# EAGLE design Grove Shield for Intel Joule v1.0 (EAGLE 6.4)
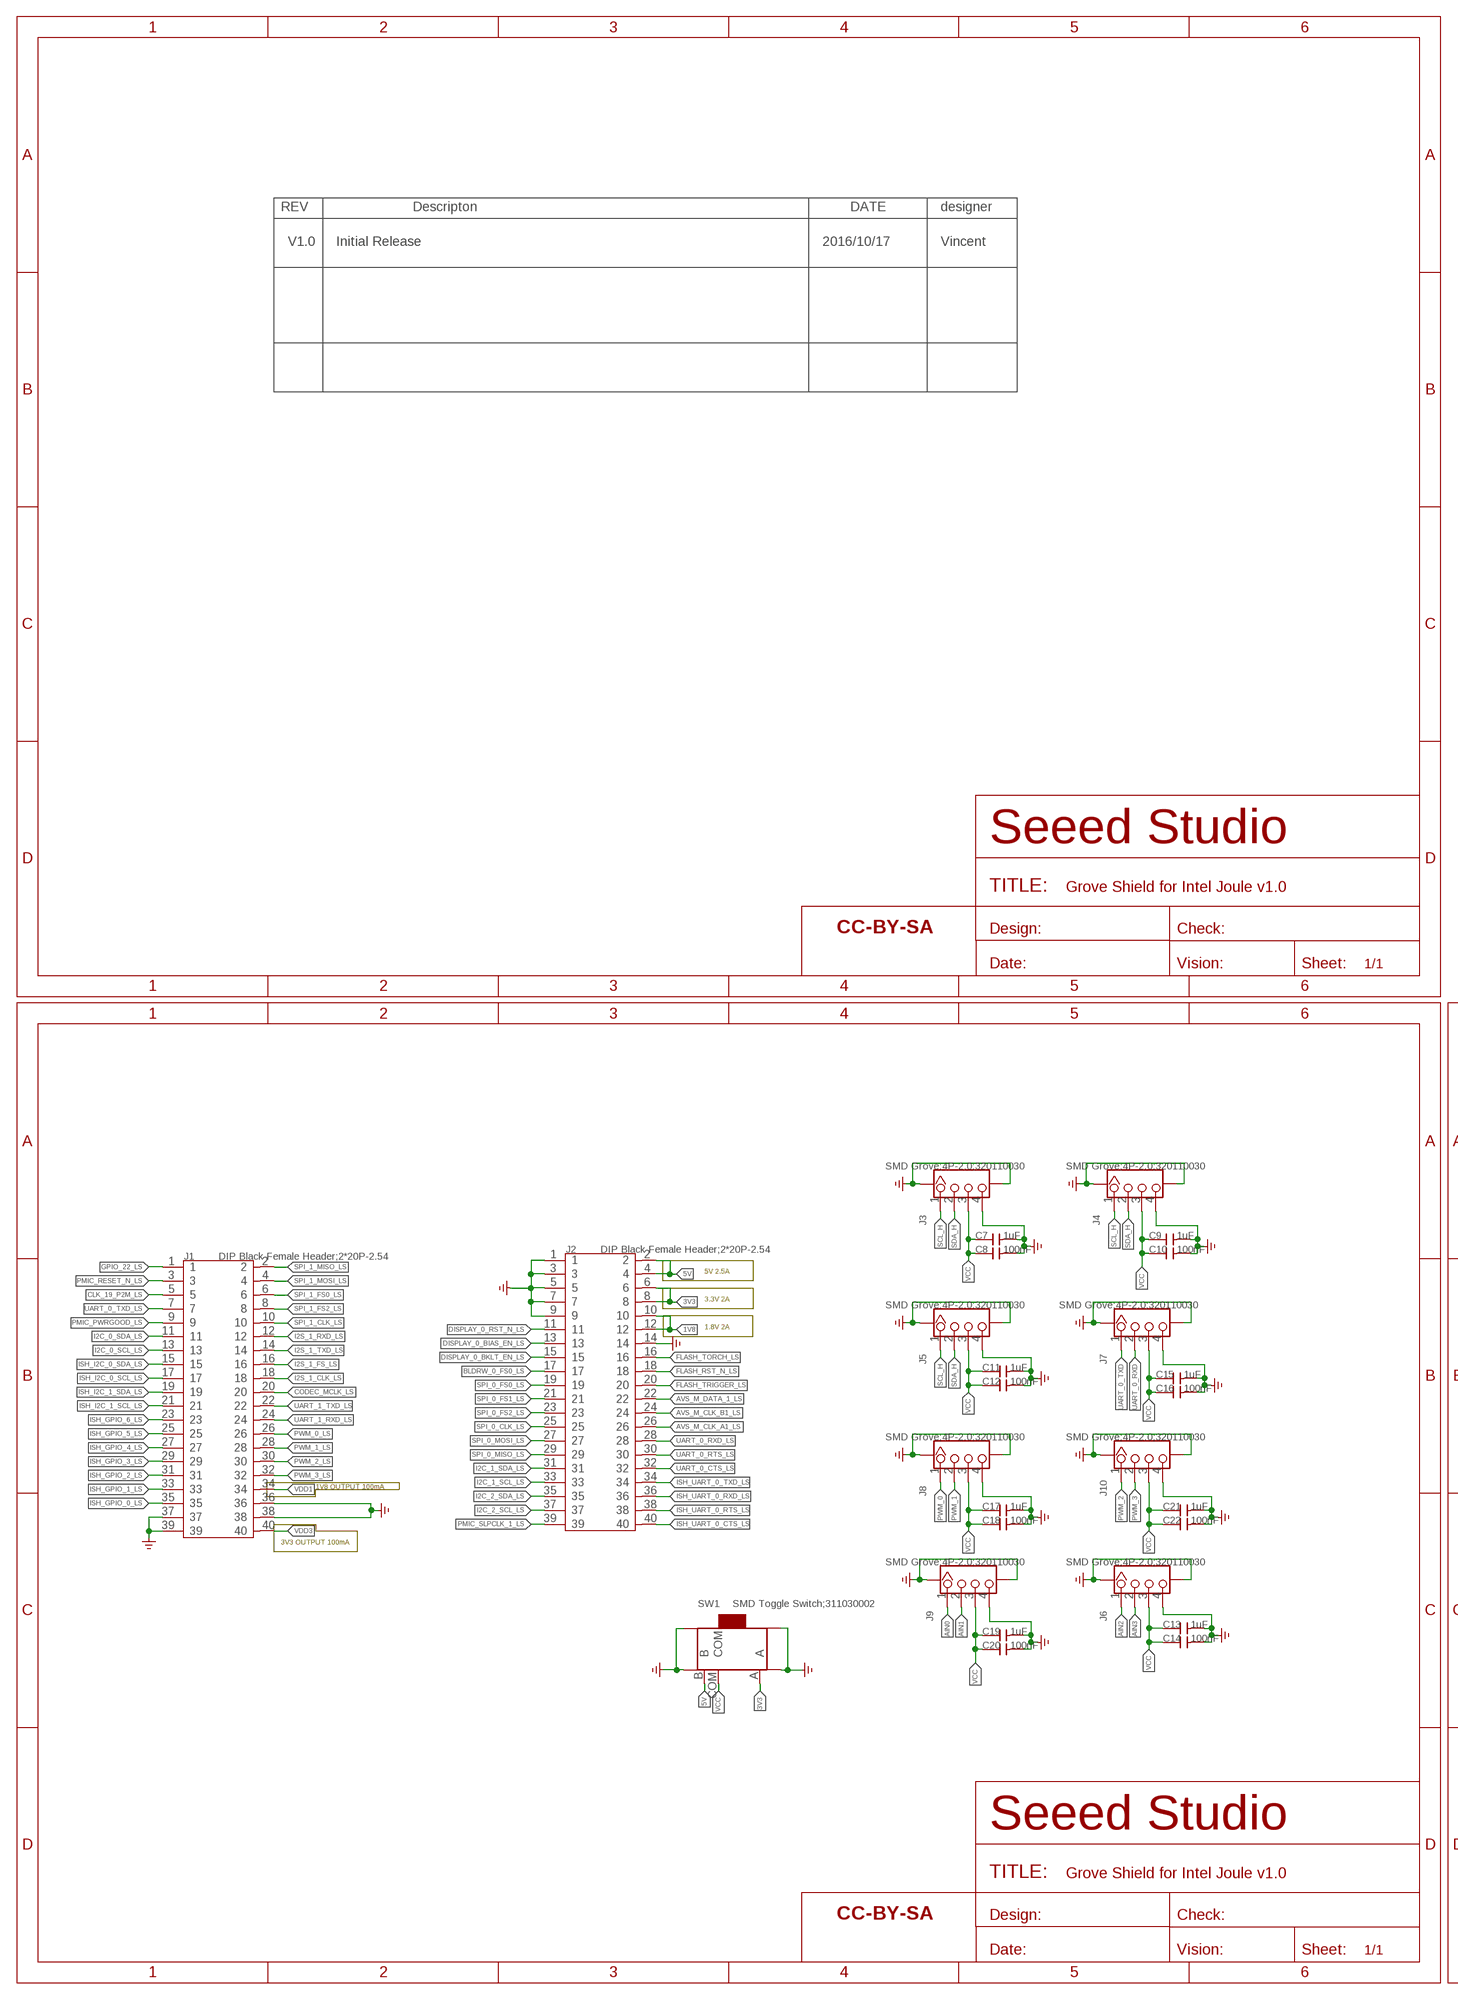
[diagram p0: schematic, sheet 1, part 1 of 2]
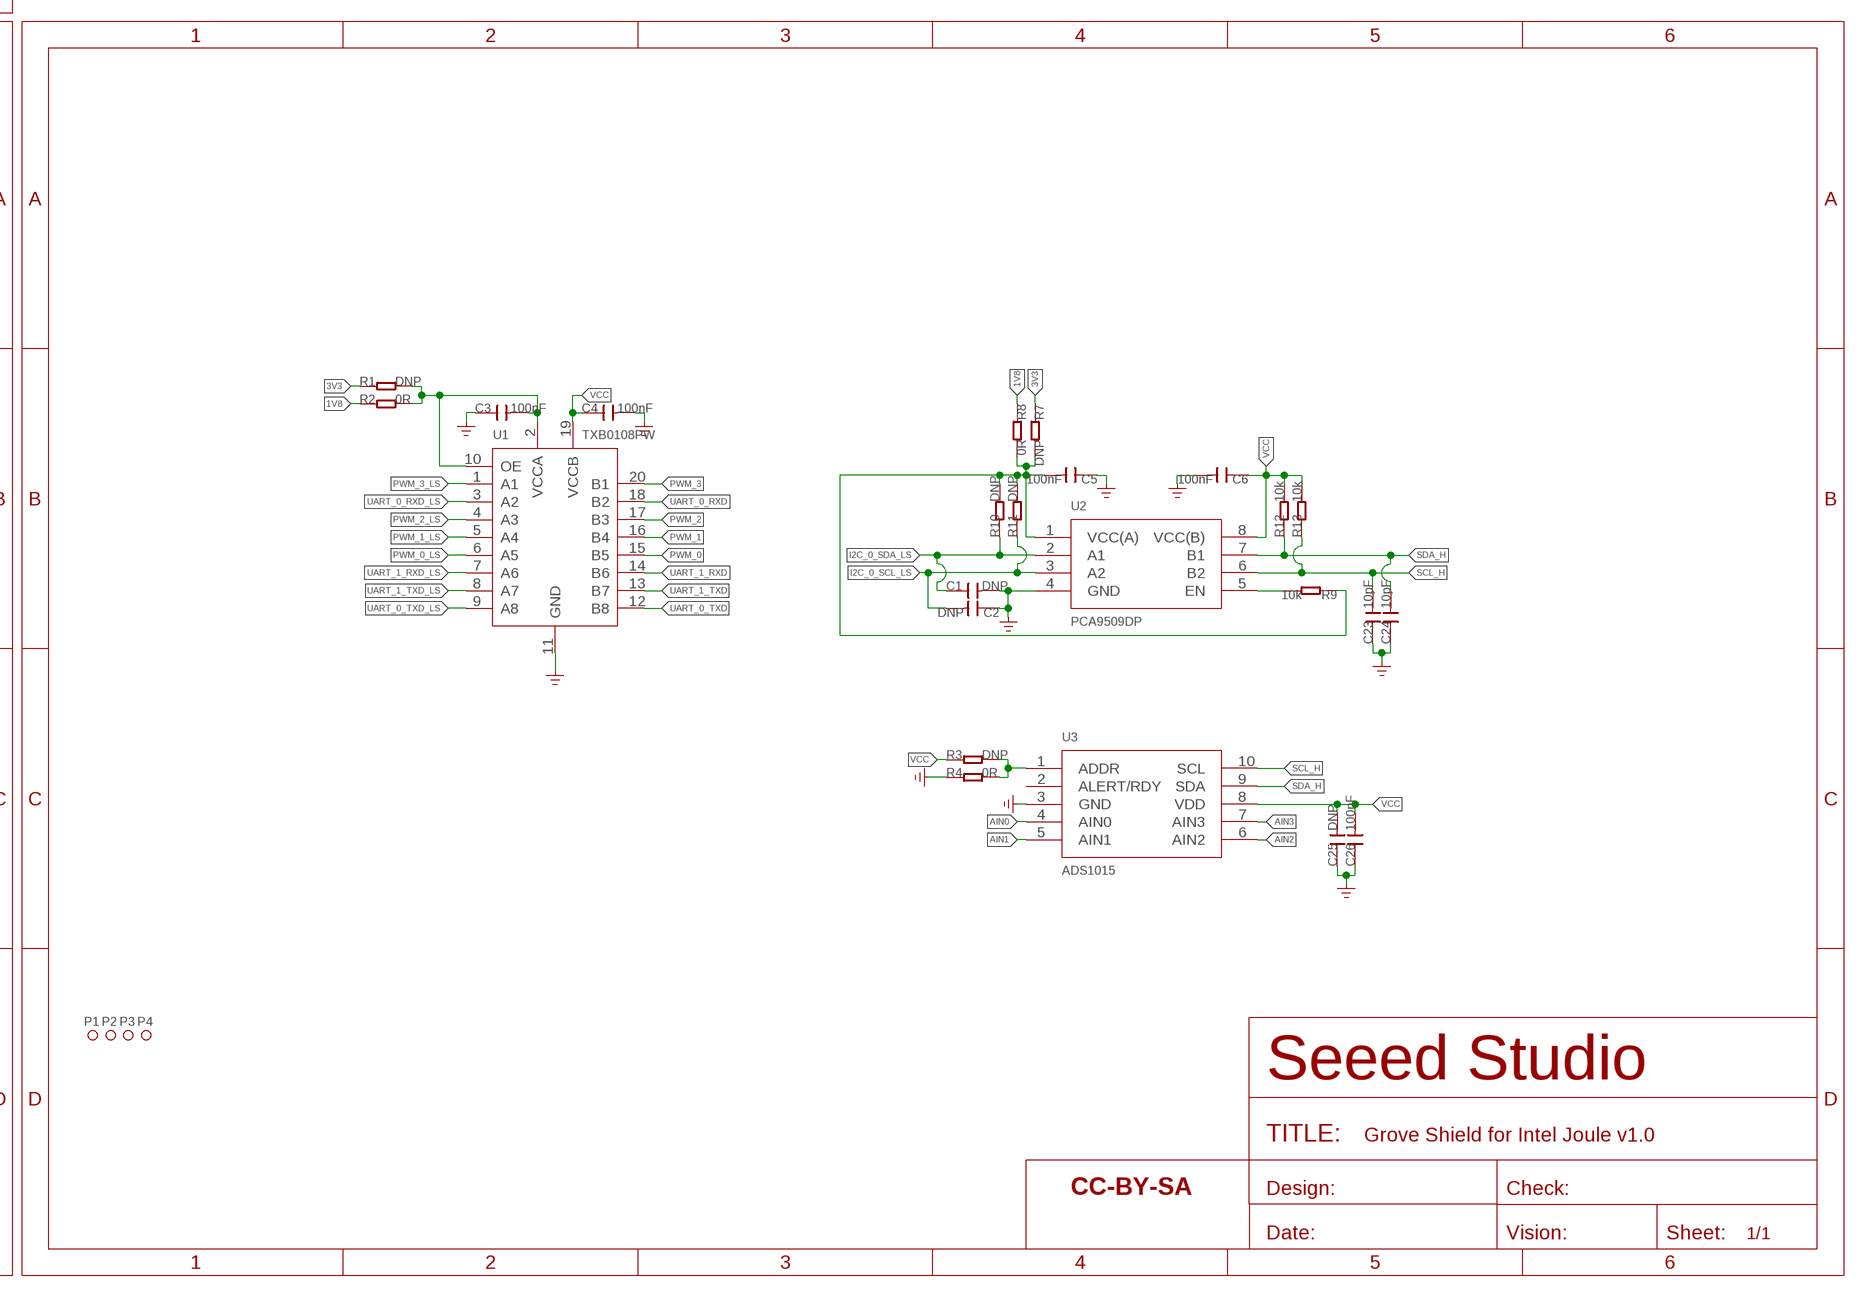
[diagram p1: schematic, sheet 1, part 2 of 2]

## Parts
C1  DNP  CAP-0603  [C0603]
C2  DNP  CAP-0603  [C0603]
C3  100nF  CAP-0603  [C0603]
C4  100nF  CAP-0603  [C0603]
C5  100nF  CAP-0603  [C0603]
C6  100nF  CAP-0603  [C0603]
C7  1uF  CAP-0603  [C0603]
C8  100nF  CAP-0603  [C0603]
C9  1uF  CAP-0603  [C0603]
C10  100nF  CAP-0603  [C0603]
C11  1uF  CAP-0603  [C0603]
C12  100nF  CAP-0603  [C0603]
C13  1uF  CAP-0603  [C0603]
C14  100nF  CAP-0603  [C0603]
C15  1uF  CAP-0603  [C0603]
C16  100nF  CAP-0603  [C0603]
C17  1uF  CAP-0603  [C0603]
C18  100nF  CAP-0603  [C0603]
C19  1uF  CAP-0603  [C0603]
C20  100nF  CAP-0603  [C0603]
C21  1uF  CAP-0603  [C0603]
C22  100nF  CAP-0603  [C0603]
C23  10pF  CAP-0603  [C0603]
C24  10pF  CAP-0603  [C0603]
C25  DNP  CAP-0603  [C0603]
C26  100nF  CAP-0603  [C0603]
FR1  SEEEDSTUDIO-OPEN-SCH-FRAME  [SEEEDSTUDIO-PCB-FRAME]
FR2  SEEEDSTUDIO-OPEN-SCH-FRAME  [SEEEDSTUDIO-PCB-FRAME]
FR3  SEEEDSTUDIO-OPEN-SCH-FRAME  [SEEEDSTUDIO-PCB-FRAME]
J1  DIP Black Female Header;2*20P-2.54  HEADER-2X20P-2.54  [H2X20-2.54MM]
J2  DIP Black Female Header;2*20P-2.54  HEADER-2X20P-2.54  [H2X20-2.54MM]
J3  SMD Grove;4P-2.0;320110030  GROVE-CONNECTOR-SMD'DD'  [HW4-SMD-2.0]
J4  SMD Grove;4P-2.0;320110030  GROVE-CONNECTOR-SMD'DD'  [HW4-SMD-2.0]
J5  SMD Grove;4P-2.0;320110030  GROVE-CONNECTOR-SMD'DD'  [HW4-SMD-2.0]
J6  SMD Grove;4P-2.0;320110030  GROVE-CONNECTOR-SMD'DD'  [HW4-SMD-2.0]
J7  SMD Grove;4P-2.0;320110030  GROVE-CONNECTOR-SMD'DD'  [HW4-SMD-2.0]
J8  SMD Grove;4P-2.0;320110030  GROVE-CONNECTOR-SMD'DD'  [HW4-SMD-2.0]
J9  SMD Grove;4P-2.0;320110030  GROVE-CONNECTOR-SMD'DD'  [HW4-SMD-2.0]
J10  SMD Grove;4P-2.0;320110030  GROVE-CONNECTOR-SMD'DD'  [HW4-SMD-2.0]
P1  MARK-1.0'ANNULAR'  [ROUND-MARK-1.0]
P2  MARK-1.0'ANNULAR'  [ROUND-MARK-1.0]
P3  MARK-1.0'ANNULAR'  [ROUND-MARK-1.0]
P4  MARK-1.0'ANNULAR'  [ROUND-MARK-1.0]
R1  DNP  RES-0603  [R0603]
R2  0R  RES-0603  [R0603]
R3  DNP  RES-0603  [R0603]
R4  0R  RES-0603  [R0603]
R7  DNP  RES-0603  [R0603]
R8  0R  RES-0603  [R0603]
R9  10k  RES-0603  [R0603]
R10  DNP  RES-0603  [R0603]
R11  DNP  RES-0603  [R0603]
R12  10k  RES-0603  [R0603]
R13  10k  RES-0603  [R0603]
SW1  SMD Toggle Switch;311030002  SWITCH-3+4P'90D'  [SW7-SMD-6.7X2.6X1.4MM-90D]
U1  TXB0108PW  LOGIC-TXS0108EPWR  [TSSOP20-0.65-6.5X4.4MM]
U2  PCA9509DP  LOGIC-PCA9509DP  [TSSOP8-0.65-3X3MM]
U3  ADS1015  CONVERTER-ADS1015IDGST-ADC  [SSOP10-0.5-3X3MM]

## Nets
1V8: J2.10 J2.12 R2.1 R8.1
3V3: J2.6 J2.8 R1.1 R7.1 SW1.A
5V: J2.2 J2.4 SW1.B
AIN0: J9.1 U3.4(AIN0)
AIN1: J9.2 U3.5(AIN1)
AIN2: J6.1 U3.6(AIN2)
AIN3: J6.2 U3.7(AIN3)
AVS_M_CLK_A1_LS: J2.26
AVS_M_CLK_B1_LS: J2.24
AVS_M_DATA_1_LS: J2.22
BLDRW_0_FS0_LS: J2.17
CLK_19_P2M_LS: J1.5
CODEC_MCLK_LS: J1.20
DISPLAY_0_BIAS_EN_LS: J2.13
DISPLAY_0_BKLT_EN_LS: J2.15
DISPLAY_0_RST_N_LS: J2.11
FLASH_RST_N_LS: J2.18
FLASH_TORCH_LS: J2.16
FLASH_TRIGGER_LS: J2.20
GND: C1.2 C2.1 C3.1 C4.2 C5.1 C6.2 C7.2 C8.2 C9.2 C10.2 C11.2 C12.2 C13.2 C14.2 C15.2 C16.2 C17.2 C18.2 C19.2 C20.2 C21.2 C22.2 C23.1 C24.1 C25.1 C26.1 J1.36 J1.37 J1.38 J1.39 J2.1 J2.3 J2.5 J2.7 J2.9 J2.14 J3.4 J3.SS1 J3.SS2 J4.4 J4.SS1 J4.SS2 J5.4 J5.SS1 J5.SS2 J6.4 J6.SS1 J6.SS2 J7.4 J7.SS1 J7.SS2 J8.4 J8.SS1 J8.SS2 J9.4 J9.SS1 J9.SS2 J10.4 J10.SS1 J10.SS2 R4.1 SW1.P1(SS1) SW1.P2(SS2) SW1.P3(SS3) SW1.P4(SS4) U1.11(GND) U2.4(GND) U3.3(GND) ; supply symbol labelled GND_POWER
GPIO_22_LS: J1.1
I2C_0_SCL_LS: C2.2 J1.13 R11.1 U2.3(A2)
I2C_0_SDA_LS: C1.1 J1.11 R10.1 U2.2(A1)
I2C_1_SCL_LS: J2.33
I2C_1_SDA_LS: J2.31
I2C_2_SCL_LS: J2.37
I2C_2_SDA_LS: J2.35
I2S_1_CLK_LS: J1.18
I2S_1_FS_LS: J1.16
I2S_1_RXD_LS: J1.12
I2S_1_TXD_LS: J1.14
ISH_GPIO_0_LS: J1.35
ISH_GPIO_1_LS: J1.33
ISH_GPIO_2_LS: J1.31
ISH_GPIO_3_LS: J1.29
ISH_GPIO_4_LS: J1.27
ISH_GPIO_5_LS: J1.25
ISH_GPIO_6_LS: J1.23
ISH_I2C_0_SCL_LS: J1.17
ISH_I2C_0_SDA_LS: J1.15
ISH_I2C_1_SCL_LS: J1.21
ISH_I2C_1_SDA_LS: J1.19
ISH_UART_0_CTS_LS: J2.40
ISH_UART_0_RTS_LS: J2.38
ISH_UART_0_RXD_LS: J2.36
ISH_UART_0_TXD_LS: J2.34
N$1: R9.2 U2.5(EN)
N$2: R3.2 R4.2 U3.1(ADDR)
N$4: C5.2 R7.2 R8.2 R9.1 R10.2 R11.2 U2.1(VCC(A))
N$5: C3.2 R1.2 R2.2 U1.2(VCCA) U1.10(OE)
PMIC_PWRGOOD_LS: J1.9
PMIC_RESET_N_LS: J1.3
PMIC_SLPCLK_1_LS: J2.39
PWM_0: J8.1 U1.15(B5)
PWM_0_LS: J1.26 U1.6(A5)
PWM_1: J8.2 U1.16(B4)
PWM_1_LS: J1.28 U1.5(A4)
PWM_2: J10.1 U1.17(B3)
PWM_2_LS: J1.30 U1.4(A3)
PWM_3: J10.2 U1.20(B1)
PWM_3_LS: J1.32 U1.1(A1)
SCL_H: C23.2 J3.1 J4.1 J5.1 R13.1 U2.6(B2) U3.10(SCL)
SDA_H: C24.2 J3.2 J4.2 J5.2 R12.1 U2.7(B1) U3.9(SDA)
SPI_0_CLK_LS: J2.25
SPI_0_FS0_LS: J2.19
SPI_0_FS1_LS: J2.21
SPI_0_FS2_LS: J2.23
SPI_0_MISO_LS: J2.29
SPI_0_MOSI_LS: J2.27
SPI_1_CLK_LS: J1.10
SPI_1_FS0_LS: J1.6
SPI_1_FS2_LS: J1.8
SPI_1_MISO_LS: J1.2
SPI_1_MOSI_LS: J1.4
UART_0_CTS_LS: J2.32
UART_0_RTS_LS: J2.30
UART_0_RXD: J7.2 U1.18(B2)
UART_0_RXD_LS: J2.28 U1.3(A2)
UART_0_TXD: J7.1 U1.12(B8)
UART_0_TXD_LS: J1.7 U1.9(A8)
UART_1_RXD: U1.14(B6)
UART_1_RXD_LS: J1.24 U1.7(A6)
UART_1_TXD: U1.13(B7)
UART_1_TXD_LS: J1.22 U1.8(A7)
VCC: C4.1 C6.1 C7.1 C8.1 C9.1 C10.1 C11.1 C12.1 C13.1 C14.1 C15.1 C16.1 C17.1 C18.1 C19.1 C20.1 C21.1 C22.1 C25.2 C26.2 J3.3 J4.3 J5.3 J6.3 J7.3 J8.3 J9.3 J10.3 R3.1 R12.2 R13.2 SW1.COM U1.19(VCCB) U2.8(VCC(B)) U3.8(VDD)
VDD1: J1.34
VDD3: J1.40
Unconnected: U3.2(ALERT/RDY)

## Notes on the sheet
- REV | Descripton | DATE | designer
- V1.0 | Initial Release | 2016/10/17 | Vincent
- 5V 2.5A
- 3.3V 2A
- 1.8V 2A
- 1V8 OUTPUT 100mA
- 3V3 OUTPUT 100mA

## Library data of the parts
C1-C26 = Discrete-new:CAP: Ceramic Capacitors
FR1-FR3 = moudle-new:SEEEDSTUDIO-OPEN-SCH-FRAME
J1 J2 = Connector-new:HEADER-2X20P-2.54
J3-J10 = Connector-new:GROVE-CONNECTOR-SMD: 4P-SMD-2.0:320110030;4P-SMD-2.0-90D:320110032
P1-P4 = Discrete-new:MARK-1.0; PARTNO: DNP
R1-R4 R7-R13 = Discrete-new:RES
SW1 = Discrete-new:SWITCH-3+4P: SW7-SMD-6.7X2.6X1.4MM-90D:311030002;SW7-SMD-L6.7X2.7X3.2MM:311030001
U1 = IC-new:LOGIC-TXS0108EPWR: 310050026
U2 = IC-new:LOGIC-PCA9509DP
U3 = IC-new:CONVERTER-ADS1015IDGST-ADC; MPN: ADS1015IDGST-ADC-兼容1.8V-3.3V

## Board
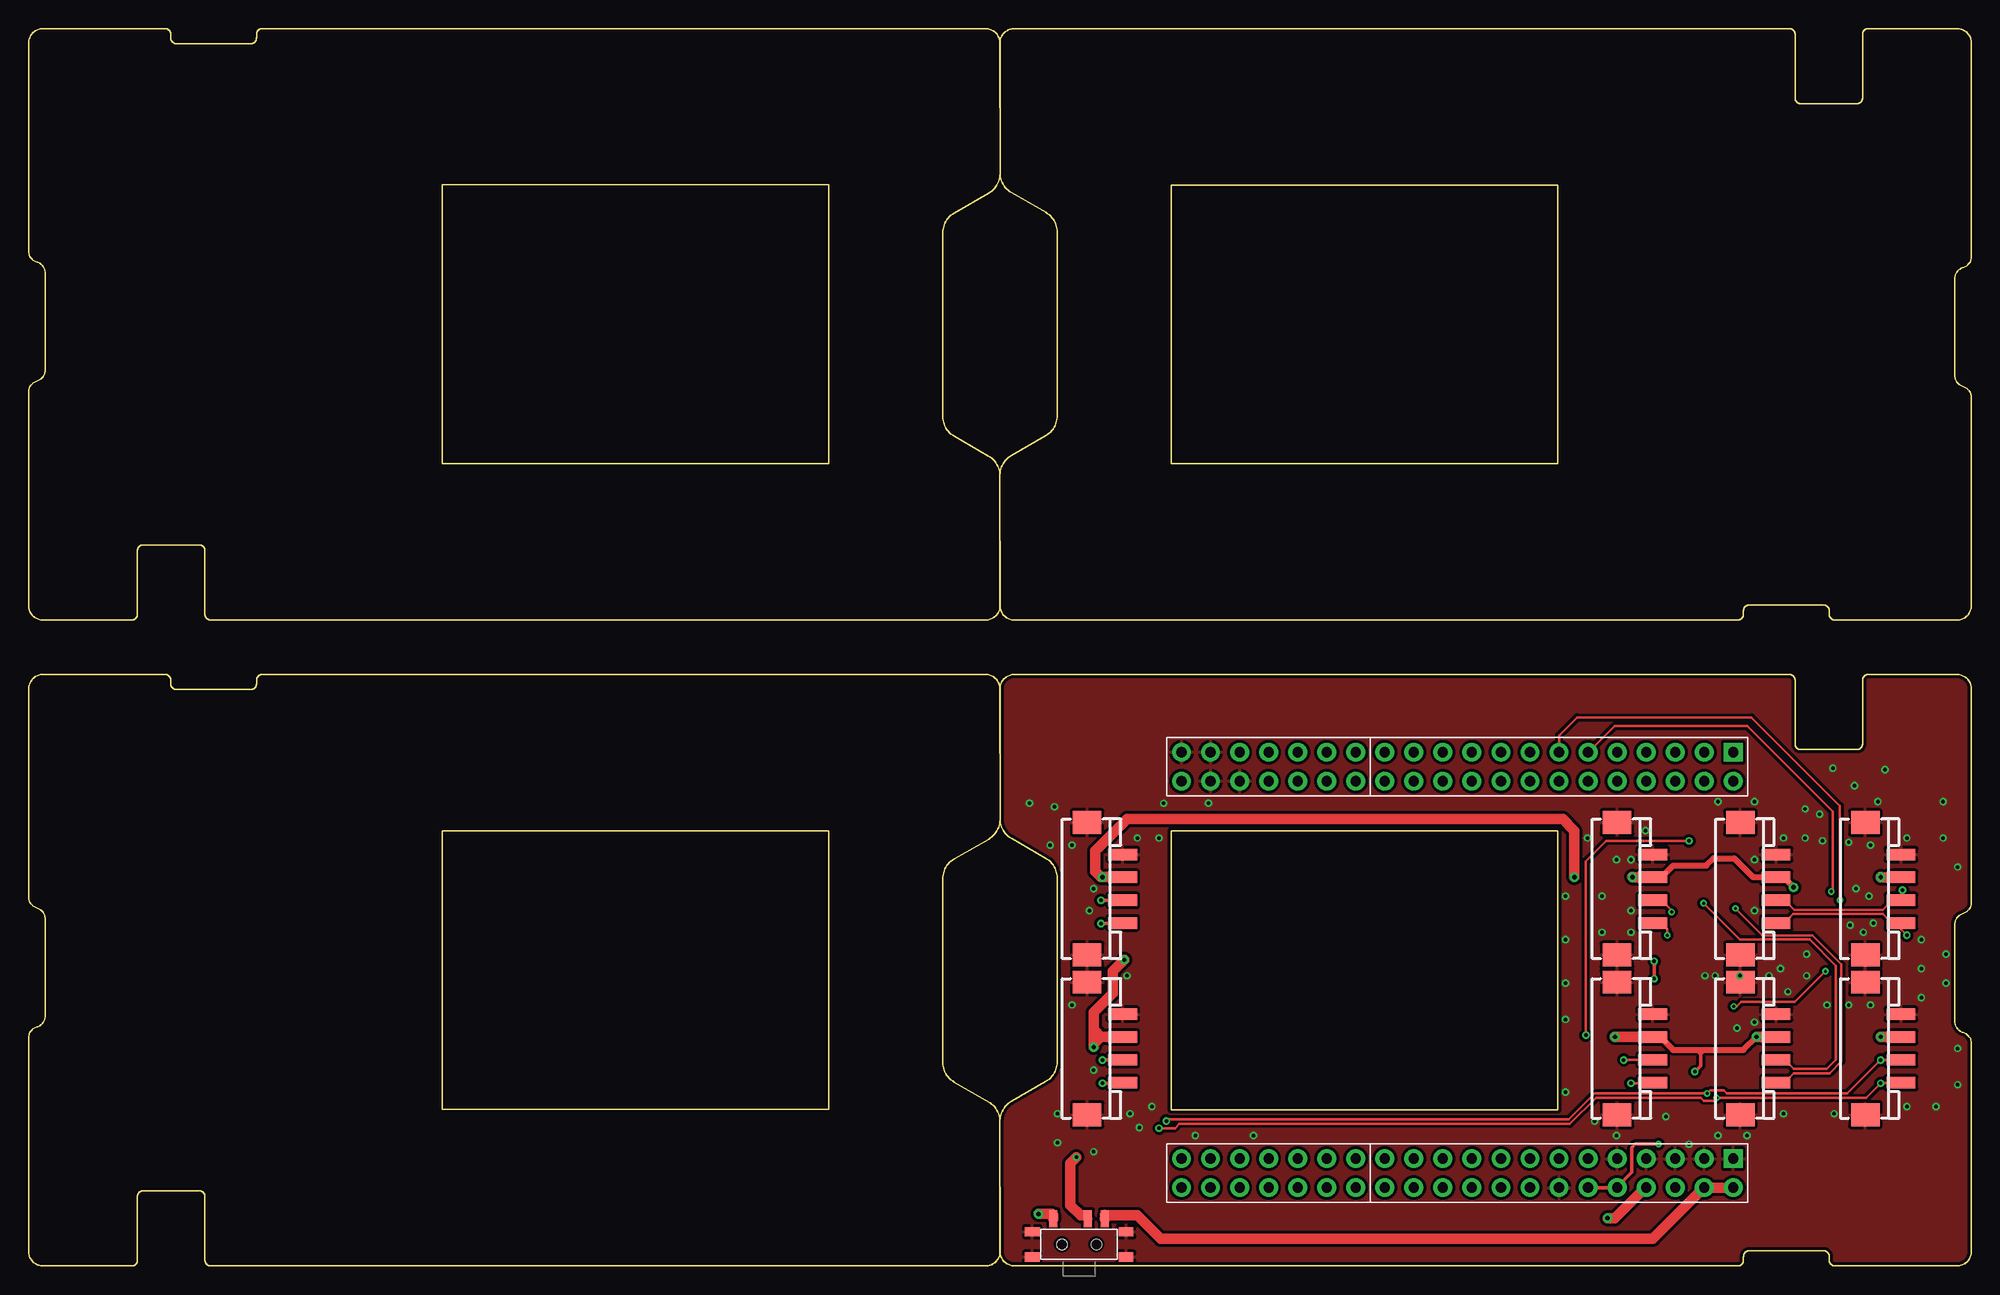
[diagram p2: board, top side]
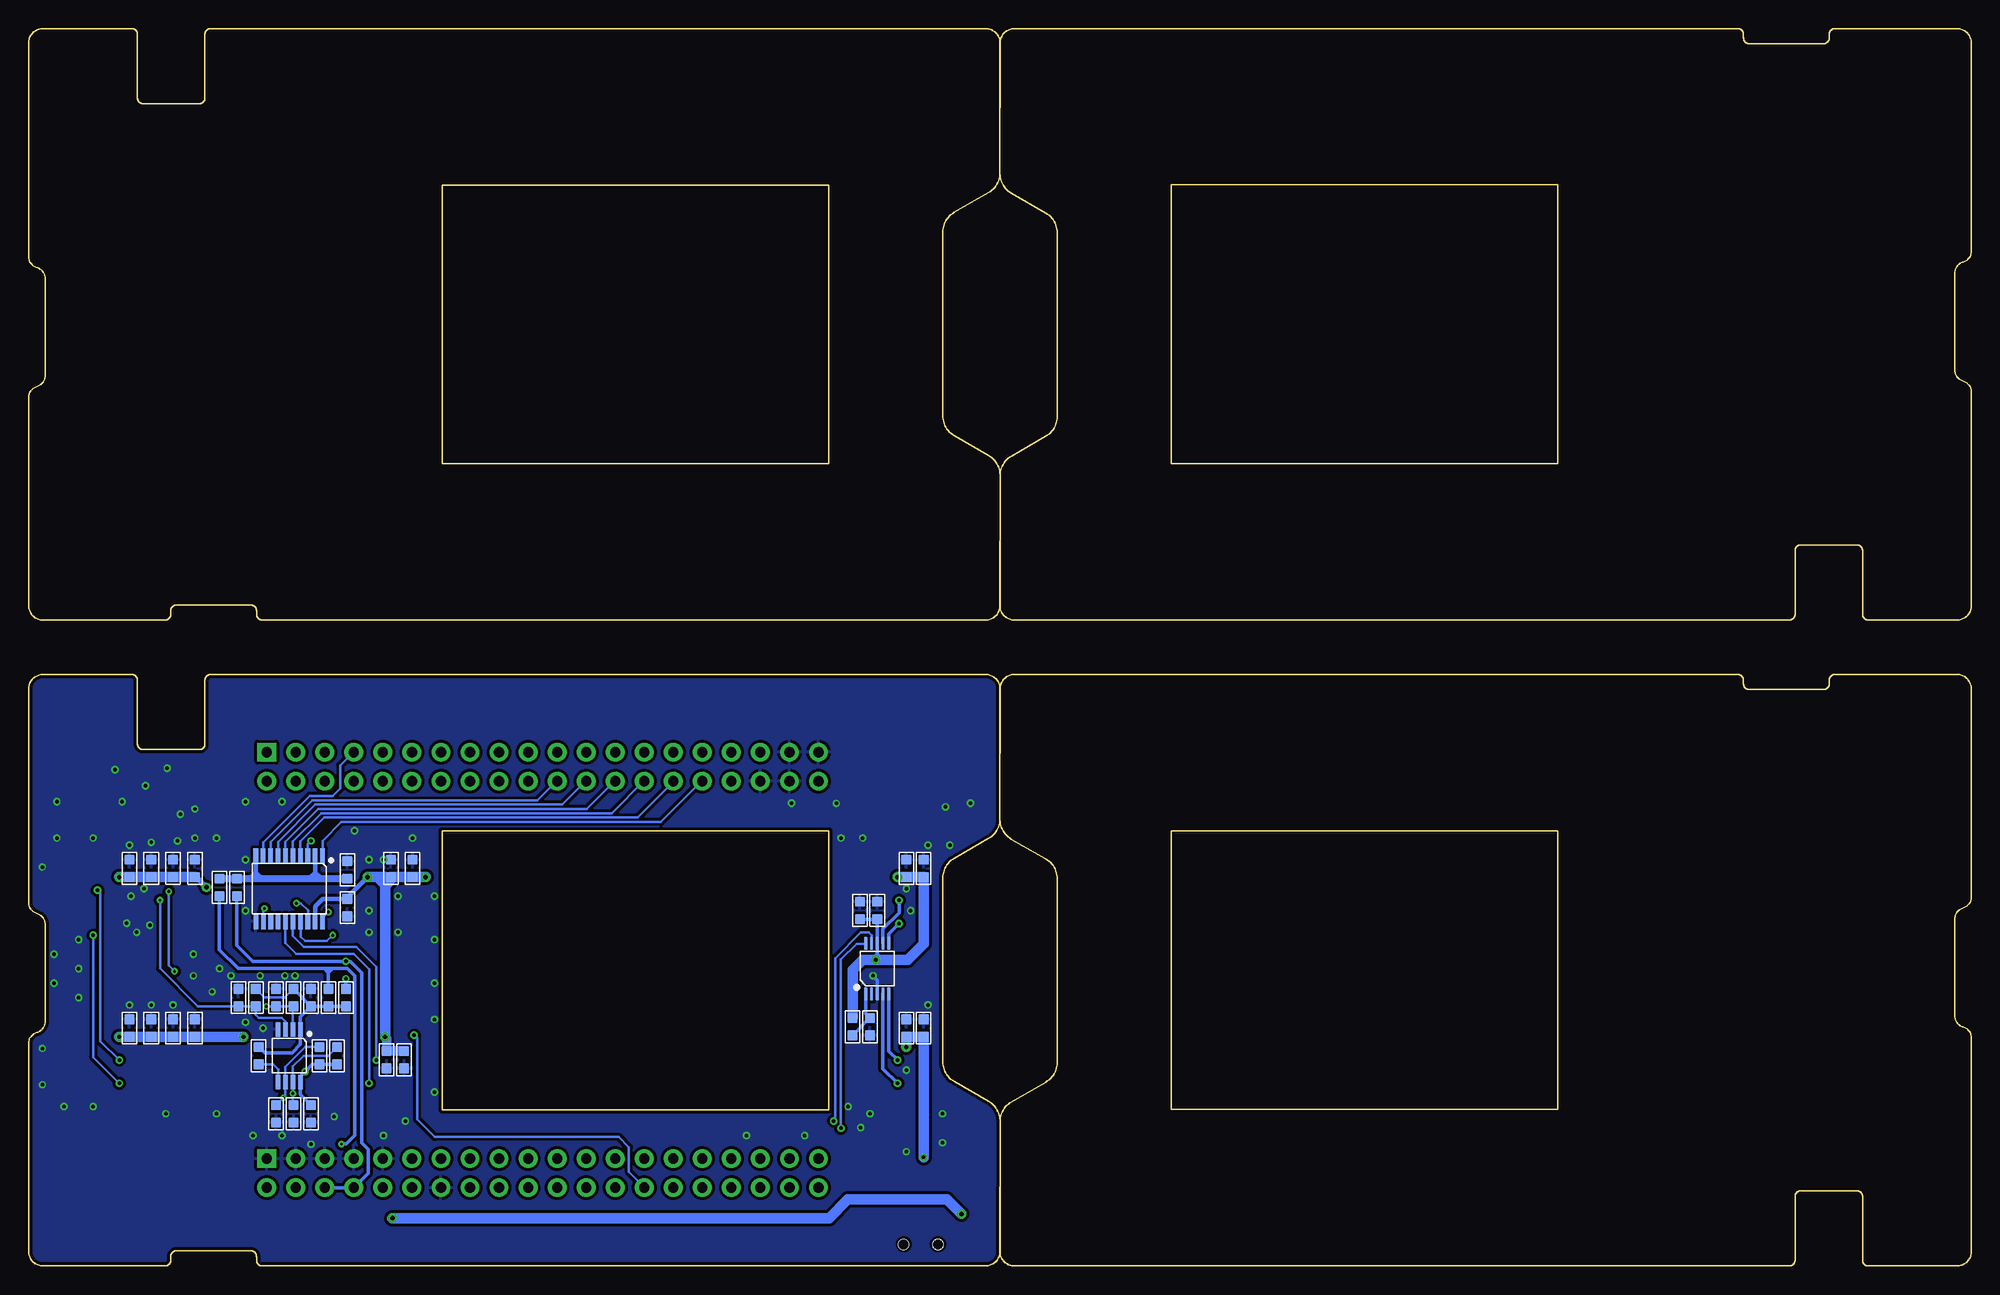
[diagram p3: board, bottom side, seen from below]

Size 169.93 x 108.27 mm. Coordinates in mm from the lower left corner, seen from the top.
Outline: 168.66,51.75 168.77,51.75 168.88,51.73 168.99,51.71 169.09,51.68 169.19,51.64 169.29,51.58 169.39,51.53 169.47,51.46 169.56,51.38 169.63,51.3 169.7,51.21 169.76,51.12 169.81,51.02 169.85,50.92 169.88,50.81 169.91,50.71 169.92,50.6 169.93,50.53 169.93,31.81 169.93,31.71 169.91,31.61 169.89,31.52 169.85,31.42 169.81,31.33 169.76,31.25 169.7,31.17 169.63,31.1 169.56,31.03 169.48,30.97 169.39,30.92 169.3,30.88 169.2,30.85 169.11,30.82 169.02,30.78 168.93,30.73 168.85,30.67 168.78,30.6 168.71,30.53 168.65,30.45 168.6,30.36 168.56,30.28 168.52,30.18 168.5,30.09 168.49,29.99 168.48,29.89 168.48,21.39 168.49,21.29 168.5,21.19 168.52,21.09 168.56,21 168.6,20.91 168.65,20.82 168.71,20.74 168.78,20.67 168.85,20.61 168.93,20.55 169.02,20.5 169.11,20.46 169.21,20.42 169.3,20.39 169.39,20.35 169.48,20.3 169.56,20.24 169.63,20.18 169.7,20.11 169.76,20.02 169.81,19.94 169.85,19.85 169.89,19.76 169.91,19.66 169.93,19.56 169.93,19.46 169.93,1.27 arc-90 168.66,0 158,0 arc-90 157.49,0.5
Outline: 86.23,51.75 86.12,51.75 86.01,51.73 85.91,51.71 85.8,51.68 85.7,51.64 85.6,51.58 85.51,51.53 85.42,51.46 85.34,51.38 85.26,51.3 85.19,51.21 85.14,51.12 85.08,51.02 85.04,50.92 85.01,50.81 84.99,50.71 84.97,50.6 84.96,50.48 84.97,39.13 arc60 85.97,37.4 88.97,35.67 arc-60 89.97,33.94 89.97,17.88 arc-60 88.97,16.14 85.97,14.41 arc60 84.96,12.68 84.96,1.27 arc90 86.23,0 149.49,0 arc90 149.99,0.51 149.99,0.82 arc-90 150.5,1.33 156.99,1.33 arc-90 157.49,0.82 157.49,0.4
Outline: 86.21,51.76 153.99,51.76 arc-90 154.5,51.25 154.5,45.68 arc90 155.01,45.18 159.9,45.18 arc90 160.41,45.68 160.41,51.25 arc-90 160.92,51.76 168.73,51.76
Outline: 1.27,0 1.16,0.01 1.05,0.02 0.94,0.04 0.84,0.08 0.74,0.12 0.64,0.17 0.54,0.23 0.46,0.3 0.37,0.37 0.3,0.46 0.23,0.54 0.17,0.64 0.12,0.73 0.08,0.84 0.05,0.94 0.02,1.05 0.01,1.16 0,1.23 0,19.95 0,20.04 0.02,20.14 0.04,20.24 0.08,20.33 0.12,20.42 0.17,20.51 0.23,20.59 0.3,20.66 0.37,20.73 0.45,20.78 0.54,20.83 0.63,20.88 0.73,20.91 0.82,20.94 0.91,20.98 1,21.03 1.08,21.09 1.15,21.15 1.22,21.23 1.28,21.31 1.33,21.39 1.37,21.48 1.41,21.57 1.43,21.67 1.44,21.77 1.45,21.87 1.45,30.37 1.44,30.47 1.43,30.57 1.41,30.66 1.37,30.76 1.33,30.85 1.28,30.93 1.22,31.01 1.15,31.08 1.08,31.15 1,31.21 0.91,31.26 0.82,31.3 0.72,31.33 0.63,31.36 0.54,31.4 0.45,31.45 0.37,31.51 0.3,31.58 0.23,31.65 0.17,31.73 0.12,31.82 0.08,31.9 0.04,32 0.02,32.09 0,32.19 0,32.29 0,50.48 arc-90 1.27,51.75 11.93,51.75 arc-90 12.44,51.25
Outline: 83.7,0 83.81,0.01 83.92,0.02 84.02,0.04 84.13,0.08 84.23,0.12 84.33,0.17 84.42,0.23 84.51,0.3 84.59,0.37 84.67,0.46 84.74,0.54 84.79,0.64 84.85,0.73 84.89,0.84 84.92,0.94 84.94,1.05 84.96,1.16 84.97,1.27 84.96,12.63 arc60 83.96,14.36 80.96,16.09 arc-60 79.96,17.82 79.96,33.88 arc-60 80.96,35.61 83.96,37.34 arc60 84.97,39.07 84.97,50.48 arc90 83.7,51.75 20.44,51.75 arc90 19.94,51.25 19.94,50.94 arc-90 19.43,50.43 12.94,50.43 arc-90 12.44,50.94 12.44,51.36
Outline: 83.72,0 15.94,0 arc-90 15.43,0.51 15.43,6.07 arc90 14.92,6.58 10.03,6.58 arc90 9.52,6.07 9.52,0.51 arc-90 9.01,0 1.2,0
Outline: 168.66,108.27 168.77,108.26 168.88,108.25 168.99,108.23 169.09,108.19 169.19,108.15 169.29,108.1 169.39,108.04 169.47,107.97 169.56,107.9 169.63,107.82 169.7,107.73 169.76,107.63 169.81,107.54 169.85,107.43 169.88,107.33 169.91,107.22 169.92,107.11 169.93,107.04 169.93,88.32 169.93,88.23 169.91,88.13 169.89,88.03 169.85,87.94 169.81,87.85 169.76,87.76 169.7,87.68 169.63,87.61 169.56,87.54 169.48,87.49 169.39,87.44 169.3,87.4 169.2,87.36 169.11,87.33 169.02,87.29 168.93,87.24 168.85,87.18 168.78,87.12 168.71,87.04 168.65,86.96 168.6,86.88 168.56,86.79 168.52,86.7 168.5,86.6 168.49,86.5 168.48,86.4 168.48,77.9 168.49,77.8 168.5,77.7 168.52,77.61 168.56,77.51 168.6,77.42 168.65,77.34 168.71,77.26 168.78,77.19 168.85,77.12 168.93,77.06 169.02,77.01 169.11,76.97 169.21,76.94 169.3,76.91 169.39,76.87 169.48,76.82 169.56,76.76 169.63,76.69 169.7,76.62 169.76,76.54 169.81,76.46 169.85,76.37 169.89,76.27 169.91,76.18 169.93,76.08 169.93,75.98 169.93,57.79 arc-90 168.66,56.52 158,56.52 arc-90 157.49,57.02
Outline: 86.23,108.27 86.12,108.26 86.01,108.25 85.91,108.23 85.8,108.19 85.7,108.15 85.6,108.1 85.51,108.04 85.42,107.97 85.34,107.9 85.26,107.82 85.19,107.73 85.14,107.63 85.08,107.54 85.04,107.43 85.01,107.33 84.99,107.22 84.97,107.11 84.96,107 84.97,95.65 arc60 85.97,93.91 88.97,92.18 arc-60 89.97,90.45 89.97,74.39 arc-60 88.97,72.66 85.97,70.93 arc60 84.96,69.2 84.96,57.79 arc90 86.23,56.52 149.49,56.52 arc90 149.99,57.03 149.99,57.33 arc-90 150.5,57.84 156.99,57.84 arc-90 157.49,57.33 157.49,56.91
Outline: 86.21,108.27 153.99,108.27 arc-90 154.5,107.76 154.5,102.2 arc90 155.01,101.69 159.9,101.69 arc90 160.41,102.2 160.41,107.76 arc-90 160.92,108.27 168.73,108.27
Outline: 1.27,56.52 1.16,56.52 1.05,56.54 0.94,56.56 0.84,56.59 0.74,56.64 0.64,56.69 0.54,56.74 0.46,56.81 0.37,56.89 0.3,56.97 0.23,57.06 0.17,57.15 0.12,57.25 0.08,57.35 0.05,57.46 0.02,57.56 0.01,57.67 0,57.74 0,76.46 0,76.56 0.02,76.66 0.04,76.76 0.08,76.85 0.12,76.94 0.17,77.02 0.23,77.1 0.3,77.17 0.37,77.24 0.45,77.3 0.54,77.35 0.63,77.39 0.73,77.42 0.82,77.45 0.91,77.49 1,77.55 1.08,77.6 1.15,77.67 1.22,77.74 1.28,77.82 1.33,77.91 1.37,77.99 1.41,78.09 1.43,78.19 1.44,78.28 1.45,78.38 1.45,86.88 1.44,86.98 1.43,87.08 1.41,87.18 1.37,87.27 1.33,87.36 1.28,87.45 1.22,87.53 1.15,87.6 1.08,87.66 1,87.72 0.91,87.77 0.82,87.81 0.72,87.85 0.63,87.88 0.54,87.92 0.45,87.97 0.37,88.03 0.3,88.09 0.23,88.17 0.17,88.25 0.12,88.33 0.08,88.42 0.04,88.51 0.02,88.61 0,88.71 0,88.81 0,107 arc-90 1.27,108.27 11.93,108.27 arc-90 12.44,107.77
Outline: 83.7,56.52 83.81,56.52 83.92,56.54 84.02,56.56 84.13,56.59 84.23,56.64 84.33,56.69 84.42,56.74 84.51,56.81 84.59,56.89 84.67,56.97 84.74,57.06 84.79,57.15 84.85,57.25 84.89,57.35 84.92,57.46 84.94,57.56 84.96,57.67 84.97,57.79 84.96,69.14 arc60 83.96,70.87 80.96,72.6 arc-60 79.96,74.33 79.96,90.39 arc-60 80.96,92.13 83.96,93.86 arc60 84.97,95.59 84.97,107 arc90 83.7,108.27 20.44,108.27 arc90 19.94,107.76 19.94,107.45 arc-90 19.43,106.94 12.94,106.94 arc-90 12.44,107.45 12.44,107.87
Outline: 83.72,56.52 15.94,56.52 arc-90 15.43,57.02 15.43,62.59 arc90 14.92,63.09 10.03,63.09 arc90 9.52,62.59 9.52,57.02 arc-90 9.01,56.52 1.2,56.52
Outline: 99.96,38.07 133.76,38.07 133.76,13.67 99.96,13.67 99.96,38.07
Outline: 69.97,13.68 36.17,13.68 36.17,38.08 69.97,38.08 69.97,13.68
Outline: 99.96,94.59 133.76,94.59 133.76,70.19 99.96,70.19 99.96,94.59
Outline: 69.97,70.2 36.17,70.2 36.17,94.6 69.97,94.6 69.97,70.2
Copper layers (1*16): Top 0.035mm / dielectric 1.5mm / Bottom 0.035mm
Design rules "SeeedStudio_2layer_DRU_no_angle_20140221 *": minimum track width 1mil, minimum drill 10mil, track to track 6mil, track to pad 6mil, pad to pad 6mil, via to via 6mil, smd to smd 0mil, copper to edge 10mil, drill to drill 10mil, minimum pad ring 10mil, minimum via ring 6mil, stop-mask expansion 2mil, vias tented up to drill 25mil, thermal gap 10mil
Holes 2.03 mm at -4.25,99.7 -4.25,8.26 173.55,8.89 173.55,99.7

### Footprints (pad centres in the part's own frame; a part is rotated, then mirrored left to right if it is on the bottom)
C0603 = smd 0.889 x 0.889: 1 0,0.762; 2 0,-0.762
H2X20-2.54MM = drill 0.889 pad 1.651 square: 1 -1.27,24.13 | drill 0.889 pad 1.651: 2 1.27,24.13; 3 -1.27,21.59; 4 1.27,21.59; 5 -1.27,19.05; 6 1.27,19.05; 7 -1.27,16.51; 8 1.27,16.51; 9 -1.27,13.97; 10 1.27,13.97; 11 -1.27,11.43; 12 1.27,11.43; 13 -1.27,8.89; 14 1.27,8.89; 15 -1.27,6.35; 16 1.27,6.35; 17 -1.27,3.81; 18 1.27,3.81; 19 -1.27,1.27; 20 1.27,1.27; 21 -1.27,-1.27; 22 1.27,-1.27; 23 -1.27,-3.81; 24 1.27,-3.81; 25 -1.27,-6.35; 26 1.27,-6.35; 27 -1.27,-8.89; 28 1.27,-8.89; 29 -1.27,-11.43; 30 1.27,-11.43; 31 -1.27,-13.97; 32 1.27,-13.97; 33 -1.27,-16.51; 34 1.27,-16.51; 35 -1.27,-19.05; 36 1.27,-19.05; 37 -1.27,-21.59; 38 1.27,-21.59; 39 -1.27,-24.13; 40 1.27,-24.13
HW4-SMD-2.0 = smd 1 x 2.5: 1 -3,0; 2 -1,0; 3 1,0; 4 3,0 | smd 2 x 2.5: SS1 -5.8,3.123; SS2 5.8,3.123
ROUND-MARK-1.0 = smd 1.016 x 1.016: P$1 0,0
R0603 = smd 0.889 x 0.889: 1 0,0.762; 2 0,-0.762
SW7-SMD-6.7X2.6X1.4MM-90D = smd 0.7 x 1.5: A -2.25,2.25; B 2.25,2.25; COM 0.75,2.25 | smd 1.3 x 0.8: P1 -4.1,1.1; P2 -4.1,-1.1; P3 4.1,-1.1; P4 4.1,1.1 | hole 0.9: -1.5,0; 1.5,0
TSSOP20-0.65-6.5X4.4MM = smd 0.4 x 1.35: 1 -2.925,-2.875; 2 -2.275,-2.875; 3 -1.625,-2.875; 4 -0.975,-2.875; 5 -0.325,-2.875; 6 0.325,-2.875; 7 0.975,-2.875; 8 1.625,-2.875; 9 2.275,-2.875; 10 2.925,-2.875; 11 2.91,2.875; 12 2.26,2.875; 13 1.61,2.875; 14 0.96,2.875; 15 0.325,2.875; 16 -0.325,2.875; 17 -0.975,2.875; 18 -1.625,2.875; 19 -2.275,2.875; 20 -2.925,2.875
TSSOP8-0.65-3X3MM = smd 0.4 x 1.27: 1 -0.975,-2.3; 2 -0.325,-2.3; 3 0.325,-2.3; 4 0.975,-2.3; 5 0.975,2.3; 6 0.325,2.3; 7 -0.325,2.3; 8 -0.975,2.3
SSOP10-0.5-3X3MM = smd 0.3 x 1.2: 1 -1,-2.2; 2 -0.5,-2.2; 3 0,-2.2; 4 0.5,-2.2; 5 1,-2.2; 6 1,2.2; 7 0.5,2.2; 8 0,2.2; 9 -0.5,2.2; 10 -1,2.2

### Placement (x,y rotation side)
C1  148.27,23.48 180 bottom
C2  151.58,23.48 0 bottom
C3  142.06,34.65 0 bottom
C4  142.06,31.35 0 bottom
C5  145.23,23.48 0 bottom
C6  145.23,13.32 0 bottom
C7  159.2,34.78 180 bottom
C8  161.11,34.78 180 bottom
C9  157.3,34.78 180 bottom
C10  155.39,34.78 180 bottom
C11  161.11,20.81 180 bottom
C12  159.2,20.81 180 bottom
C13  91.64,34.78 180 bottom
C14  93.16,34.78 180 bottom
C15  157.3,20.81 180 bottom
C16  155.39,20.81 180 bottom
C17  138.62,18.05 0 bottom
C18  137.09,18.05 0 bottom
C19  93.16,20.81 180 bottom
C20  91.64,20.81 180 bottom
C21  138.25,34.78 180 bottom
C22  136.34,34.78 180 bottom
C23  148.28,13.32 180 bottom
C24  146.76,13.32 180 bottom
C25  95.7,31.1 0 bottom
C26  97.23,31.1 0 bottom
FR1  77.15,-50.8 0 top  (outside the outline)
FR2  79.19,-41.65 0 top  (outside the outline)
FR3  73.98,-57.4 0 top  (outside the outline)
J1  124.97,43.69 270 top
J2  124.97,8.13 270 top
J3  163.77,33 90 top
J4  152.85,33 90 top
J5  163.77,19.03 90 top
J6  95.7,33 90 top
J7  152.85,19.03 90 top
J8  142.06,19.03 90 top
J9  95.7,19.03 90 top
J10  142.06,33 90 top
P1  -6.16,2.54 0 top  (outside the outline)
P2  176.09,105.41 0 top  (outside the outline)
P3  176.09,2.54 0 top  (outside the outline)
P4  -6.16,105.41 0 top  (outside the outline)
R1  151.71,33.13 180 bottom
R2  153.23,33.13 180 bottom
R3  97.86,20.94 0 bottom
R4  96.34,20.94 180 bottom
R7  142.18,23.48 0 bottom
R8  143.71,23.48 0 bottom
R9  149.8,18.4 0 bottom
R10  146.76,23.48 180 bottom
R11  150.06,23.48 180 bottom
R12  142.95,18.4 0 bottom
R13  144.47,18.4 0 bottom
SW1  91.89,1.89 0 top
U1  147.14,33 180 bottom
U2  147.14,18.4 180 bottom
U3  95.7,26.02 0 bottom

### Tracks (layer width: path | path; a pad name or v marks a point on that pad's centre or on a via)
1V8  (via drill 0.25 pad 0.51)
  Top 0.305: J2.12 J2.10 138.94,6.9 140.21,8.18 140.21,10.36 140.53,10.67 v142.56,10.67
  Bottom 0.305: 143.33,26.02 142.06,26.02 141.42,25.38 141.42,11.41 142.17,10.67 v142.56,10.67 | 143.33,26.02 143.71,26.02 | 143.71,26.02 144.09,26.02 | 144.09,26.02 151.58,26.02 153.23,27.67 R2.1 | R8.1 143.71,25.64 | 143.71,25.64 143.71,26.02 | 143.33,26.02 143.71,25.64 | 143.71,25.64 144.09,26.02
3V3  (via drill 0.3 pad 0.64, 0.38 pad 0.81)
  Top 0.305: v142.18,25.13 v142.18,26.65
  Top 0.914: SW1.A 89.64,4.39 89.48,4.56 v88.34,4.56 | J2.8 141.41,6.86 138.75,4.19 v138.11,4.19
  Bottom 0.305: J2.8 140.21,8.12 140.21,10.21 140.79,10.78 140.79,25.64 141.8,26.65 v142.18,26.65 150.31,26.65 151.71,28.05 R1.1 | R7.1 v142.18,25.13 | J2.8 141.44,6.86 | J2.8 J2.6
  Bottom 0.914: v88.34,4.56 89.61,5.83 98.28,5.83 99.91,4.19 v138.11,4.19
5V
  Top 0.61: SW1.B 94.14,4.39 94.18,4.43
  Top 0.813: SW1.B 94.14,4.52
  Top 0.914: J2.2 J2.4 146.52,6.86 142.06,2.4 99,2.4 96.97,4.43 94.43,4.43 SW1.B
AIN0  (via drill 0.3 pad 0.64)
  Top 0.305: v93.92,15.99 95.65,15.99 J9.1
  Bottom 0.305: v93.92,15.99 95.2,17.26 U3.4
AIN1  (via drill 0.3 pad 0.64)
  Top 0.305: v93.92,18.02 95.69,18.02 J9.2
  Bottom 0.305: v93.92,18.02 94.7,18.8 U3.5
AIN2  (via drill 0.3 pad 0.64)
  Top 0.305: 95.62,30.08 J6.1 95.65,29.96 v93.8,29.96
  Bottom 0.305: U3.6 94.7,29.05 v93.8,29.96
AIN3  (via drill 0.3 pad 0.64)
  Top 0.305: v93.8,31.99 95.69,31.99 J6.2
  Bottom 0.305: U3.7 95.2,29.5 93.8,30.91 v93.8,31.99
GND  (via drill 0.3 pad 0.64)
  Bottom 0.305: U3.3 95.7,25 v96.08,25.38
  other vias: 153.23,26.02 152.22,25.38 157.3,22.84 159.2,22.84 161.11,22.84 155.39,37.45 156.92,37.19 159.2,37.07 161.11,36.81 140.15,31.1 140.15,29.19 150.95,31.1 149.42,20.81 150.95,21.32 145.23,10.65 147.77,11.41 150.31,11.41 143.2,13.06 136.98,12.68 138.88,11.41 140.15,35.54 138.88,35.54 137.61,32.37 137.61,29.19 134.44,21.57 134.44,15.22 134.44,24.75 134.44,28.56 134.44,32.37 153.87,23.99 153.49,13.32 157.93,13.32 165.55,23.48 165.55,26.02 165.55,28.56 160.47,29.19 161.35,29.99 155.52,27.29 160.98,32.37 159.84,33 96.34,13.32 89.99,13.32 91.26,22.84 91.26,36.81 89.73,40.17 99.28,40.47 92.78,31.1 93.16,17.13 98.24,13.95 93.16,33 164.28,37.45 168.73,34.91 147.77,40.62 150.95,35.54 153.49,37.45 155.52,25.38 150.95,40.62 155.39,39.99 156.66,39.53 161.74,40.62 167.46,40.62 167.46,37.45 167.71,27.29 167.71,24.75 168.73,19.03 168.73,15.86 164.28,13.95 166.82,13.95 93.16,9.99 97.15,12.1 89.99,10.78 87.55,40.5 89.35,36.81 136.34,37.45 141.42,38.08 96.97,37.45 98.88,37.45 102.05,11.41 107.13,11.41 103.19,40.5 157.8,43.54 159.71,42.02 162.38,43.42 146.63,25.38 147.52,25.38 149.68,25.38 159.33,29.83
  pour Bottom (isolate 0.254): 84.78,-0.02 170,-0.02 170,52.05 84.78,52.05
  pour Top (isolate 0.254): 84.78,-0.02 170,-0.02 170,52.05 84.78,52.05
I2C_0_SCL_LS  (via drill 0.25 pad 0.51)
  Top 0.203: J1.13 133.86,46.42 135.45,48.01 150.69,48.01 158.43,40.26 v158.43,32.01
  Bottom 0.203: U2.3 147.46,21.41 147.77,21.72 149.8,21.72 150.05,21.97 R11.1 C2.2 155.11,22.72 158.43,26.04 v158.43,32.01
I2C_0_SDA_LS  (via drill 0.25 pad 0.51)
  Top 0.203: J1.11 136.46,44.96 138.75,47.25 150.31,47.25 157.8,39.75 157.8,32.89 v157.67,32.77 | v149.15,22.72 149.4,22.72 149.8,23.12 154.5,23.12 v157.16,25.78
  Bottom 0.203: U2.2 146.81,22.66 R10.1 C1.1 v149.15,22.72 | v157.67,32.77 157.67,26.29 v157.16,25.78
N$1
  Bottom 0.203: R9.2 148.53,17.64 148.11,17.21 U2.5
N$2
  Bottom 0.305: U3.1 96.7,22.07 R4.2 R3.2
N$4
  Bottom 0.203: R10.2 146.77,24.24 147.51,23.5 149.31,23.5 R11.2
  Bottom 0.305: C5.2 146.16,21.79 U2.1 146.16,19.37 146.88,18.65 149.3,18.65 R9.1 | C5.2 R8.2 R7.2 | C5.2 R10.2
N$5
  Bottom 0.305: 144.47,34.02 144.6,34.02 144.72,33.89
  Bottom 0.406: U1.2 144.86,34.41 | 144.86,34.39 144.86,33.88 | U1.10 150.06,34.4 | 150.06,34.4 150.06,33.9 | 144.86,34.41 144.47,34.02 | 144.86,34.41 144.86,34.39 | 144.86,34.39 145.23,34.02 | 150.06,34.4 149.55,33.89 | 150.06,34.4 | 150.06,34.4 150.57,33.89
  Bottom 0.61: R2.2 R1.2 150.57,33.89 149.55,33.89 144.72,33.89 C3.2
PWM_0  (via drill 0.3 pad 0.64)
  Top 0.203: v140.15,15.99 142.01,15.99 J8.1
  Bottom 0.203: U1.15 147.46,28.25 146.5,27.29 141.5,27.29 140.15,25.94 v140.15,15.99
PWM_0_LS
  Bottom 0.203: J1.26 118.67,42.42 121.1,39.99 144.6,39.99 147.46,37.12 U1.6
PWM_1  (via drill 0.3 pad 0.64)
  Top 0.203: v139.52,18.02 142.04,18.02 J8.2
  Bottom 0.203: U1.16 146.81,28.87 145.87,27.92 141.28,27.92 139.52,26.16 v139.52,18.02
PWM_1_LS
  Bottom 0.203: J1.28 116.13,42.42 118.94,39.61 144.34,39.61 146.81,37.14 U1.5
PWM_2  (via drill 0.25 pad 0.51)
  Top 0.203: J10.1 142.77,30 143.33,29.45 v143.33,28.94
  Bottom 0.203: 146.18,30.11 U1.17 146.12,30.17 146.12,28.81 145.74,28.43 143.83,28.43 v143.33,28.94
PWM_2_LS
  Bottom 0.203: J1.30 113.54,42.34 116.66,39.23 144.09,39.23 146.16,37.15 U1.4
PWM_3  (via drill 0.25 pad 0.51)
  Top 0.203: J10.2 142.8,32 143.71,31.1 v143.71,30.97
  Bottom 0.203: U1.20 144.22,30.46 v143.71,30.97
PWM_3_LS
  Bottom 0.203: J1.32 111.05,42.42 114.62,38.85 142.56,38.85 144.21,37.2 U1.1
SCL_H  (via drill 0.25 pad 0.51, 0.3 pad 0.64)
  Top 0.203: v98.88,12.05 100.27,12.05 100.65,12.43 134.82,12.43 137.1,14.72 146.25,14.72 146.5,14.46 147.39,14.46 v147.64,14.72 160.73,14.72 v162,15.99 162.04,16.03 J5.1 | J4.1 153.54,30 154.35,30.81 162.16,30.81 162.96,30 J3.1 163.77,29.45 v164.28,28.94
  Bottom 0.203: R13.1 145.74,19.16 147.46,17.44 U2.6 147.46,14.9 C23.2 v147.64,14.72 | 96.72,28.2 U3.10 96.74,28.18 97.5,28.18 98.88,26.8 v98.88,12.05 | v162,15.99 164.28,18.27 v164.28,28.94
SDA_H  (via drill 0.25 pad 0.51, 0.3 pad 0.64)
  Top 0.203: 163.79,18.02 J5.2 162.01,18.03 v162,18.02 159.07,15.1 148.53,15.1 148.28,15.35 147.07,15.35 v146.81,15.1 136.98,15.1 134.69,12.81 99.64,12.81 v99.51,12.68 | J4.2 153.6,32 153.6,31.99 154.42,31.17 162.19,31.17 163.03,32 J3.2 163.77,32.75 v163.9,32.88
  Bottom 0.203: C24.2 146.81,14.14 v146.81,15.1 U2.7 146.81,17.45 145.87,18.4 143.71,18.4 R12.1 | U3.9 96.2,28.93 96.46,29.19 97.12,29.19 99.38,26.93 99.38,12.81 v99.51,12.68 | v162,18.02 163.65,19.67 163.65,32.62 v163.9,32.88
UART_0_RXD  (via drill 0.25 pad 0.51)
  Top 0.203: v146.5,31.73 149.68,28.56 155.77,28.56 158.06,26.27 158.06,18.02 157.3,17.26 154.38,17.26 153.6,18.03 J7.2
  Bottom 0.203: U1.18 145.49,30.1 145.49,31.1 146.12,31.73 v146.5,31.73
UART_0_RXD_LS  (via drill 0.3 pad 0.64)
  Top 0.203: v145.23,37.19 137.99,37.19 136.21,35.41 v136.21,20.19
  Bottom 0.203: U1.3 145.51,36.91 v145.23,37.19 | J2.28 116.08,6.9 117.42,8.24 117.42,10.4 118.31,11.29 134.41,11.29 135.96,12.83 135.96,19.94 v136.21,20.19
UART_0_TXD  (via drill 0.25 pad 0.51)
  Top 0.203: v149.3,31.29 151.65,28.94 156.03,28.94 158.57,26.4 158.57,17.89 157.55,16.87 154.38,16.87 153.53,16.03 J7.1
  Bottom 0.203: 149.42,30.1 U1.12 149.42,30.15 149.42,31.16 v149.3,31.29
UART_0_TXD_LS
  Bottom 0.203: J1.7 141.53,44.96 142.69,43.8 142.69,41.77 143.33,41.13 145.36,41.13 149.41,37.08 U1.9
UART_1_RXD_LS
  Bottom 0.203: J1.24 121.21,42.42 123.26,40.37 144.85,40.37 148.11,37.11 U1.7
UART_1_TXD_LS
  Bottom 0.203: J1.22 123.75,42.42 125.42,40.75 145.1,40.75 148.76,37.09 U1.8
VCC  (via drill 0.3 pad 0.64, 0.38 pad 0.81)
  Top 0.305: v145.74,17 146.25,17.51 146.25,18.53 | 146.25,18.53 146.25,18.91 146.18,18.97 | 146.25,18.53 145.87,18.91 | 146.25,18.53 146.63,18.91
  Top 0.508: J8.3 142.71,20.03 143.83,18.91 145.87,18.91 146.25,18.91 146.63,18.91 149.99,18.91 v151.14,20.05 | 152.87,34.02 153.49,34.02 v154.38,33.13 | J10.3 142.8,34 143.83,35.04 146.76,35.04 147.39,35.67 149.17,35.67 150.84,34 J4.3
  Top 0.813: 152.87,34.02 J4.3 | 163.76,20.05 J5.3 | 142.04,20.05 J8.3 142.07,20.05 | 95.69,34.02 J6.3 | 95.69,20.05 J9.3 95.72,20.05 | 92.35,4.43 SW1.COM
  Top 0.914: v162,20.05 163.76,20.05 | 95.69,34.02 v93.92,34.02 93.8,34.02 93.29,34.53 93.29,36.31 96.08,39.1 134.18,39.1 135.2,38.08 v135.2,34.02 | J7.3 152.84,20.05 v151.14,20.05 | J10.3 140.29,34 v140.28,34.02 | 95.69,20.05 93.8,20.05 | 93.8,20.05 C19.1 | v93.16,19.16 93.16,19.41 | 93.16,19.41 C19.1 | C19.1 93.16,22.21 94.81,23.86 94.81,25.76 v95.83,26.78 | 93.8,20.05 93.29,20.56 | 93.8,20.05 93.16,19.41 | 92.35,4.43 92.02,4.43 91.13,5.32 91.13,9 v91.64,9.51 | J8.3 138.77,20.03 v138.75,20.05 | J3.3 162.01,34 v162,34.02
  Bottom 0.305: C6.1 146.16,15.01 U2.8 146.16,16.58 v145.74,17 145.1,17.64 R13.2 R12.2 | C26.2 C25.2 U3.8 95.7,27.29 | 95.7,27.29 95.7,26.78 | 95.7,27.29 96.08,26.91 95.32,26.91 95.7,27.29
  Bottom 0.406: U1.19 144.86,31.47 144.22,32.11 142.18,32.11 | 142.18,32.11 C4.1 | 138.88,32.11 138.75,31.99 | 142.18,32.11 v140.28,34.02
  Bottom 0.508: C10.1 155.26,34.02 v154.38,33.13
  Bottom 0.813: 138.75,33.26 138.75,33.38 | 138.75,33.38 138.75,34.02 | 138.75,33.38 138.63,33.38 | 138.75,33.38 138.88,33.38 139.39,33.89 | C18.1 C17.1 138.62,19.91 v138.75,20.05
  Bottom 0.914: 138.75,34.02 v140.28,34.02 | C10.1 C9.1 C7.1 C8.1 v162,34.02 | 137.99,34.02 C22.1 v135.2,34.02 | 137.99,34.02 C21.1 138.75,33.51 138.75,33.26 | v162,20.05 C11.1 C12.1 C15.1 C16.1 v151.14,20.05 | v138.75,20.05 138.75,31.99 138.75,33.26 | v93.92,34.02 C14.1 C13.1 91.64,28.18 93.03,26.78 95.7,26.78 v95.83,26.78 96.97,26.78 97.86,25.89 R3.1 | v91.64,9.51 C20.1 C19.1 v93.16,19.16 | 137.99,34.02 138.75,33.26